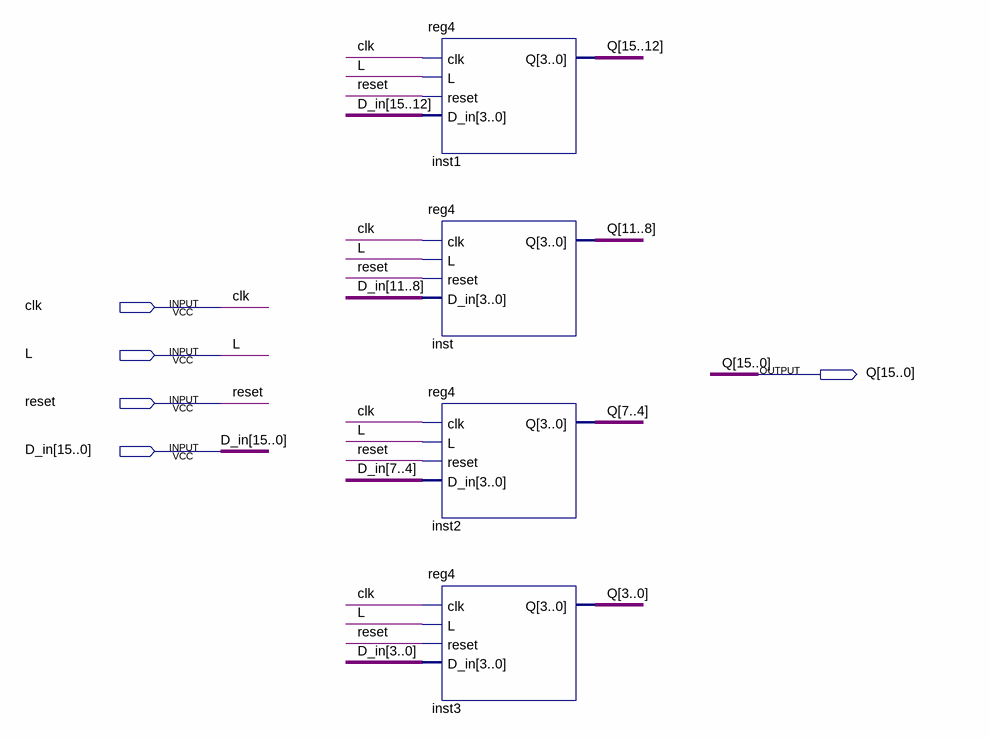
[diagram p0: schematic sheet]
// Quartus schematic reg16.bdf as structural Verilog: 4 symbols, 5 pins
module reg16 (
  input  clk,
  input  L,
  input  reset,
  input  [15:0] D_in,
  output [15:0] Q
);

  reg4 inst1 (.clk(clk), .L(L), .reset(reset), .D_in(D_in[15:12]), .Q(Q[15:12]));
  reg4 inst (.clk(clk), .L(L), .reset(reset), .D_in(D_in[11:8]), .Q(Q[11:8]));
  reg4 inst2 (.clk(clk), .L(L), .reset(reset), .D_in(D_in[7:4]), .Q(Q[7:4]));
  reg4 inst3 (.clk(clk), .L(L), .reset(reset), .D_in(D_in[3:0]), .Q(Q[3:0]));
endmodule
